# Altium schematic sheet HALL_SENSORS.SchDoc
size A2; SheetNumber: 1; SheetTotal: 1
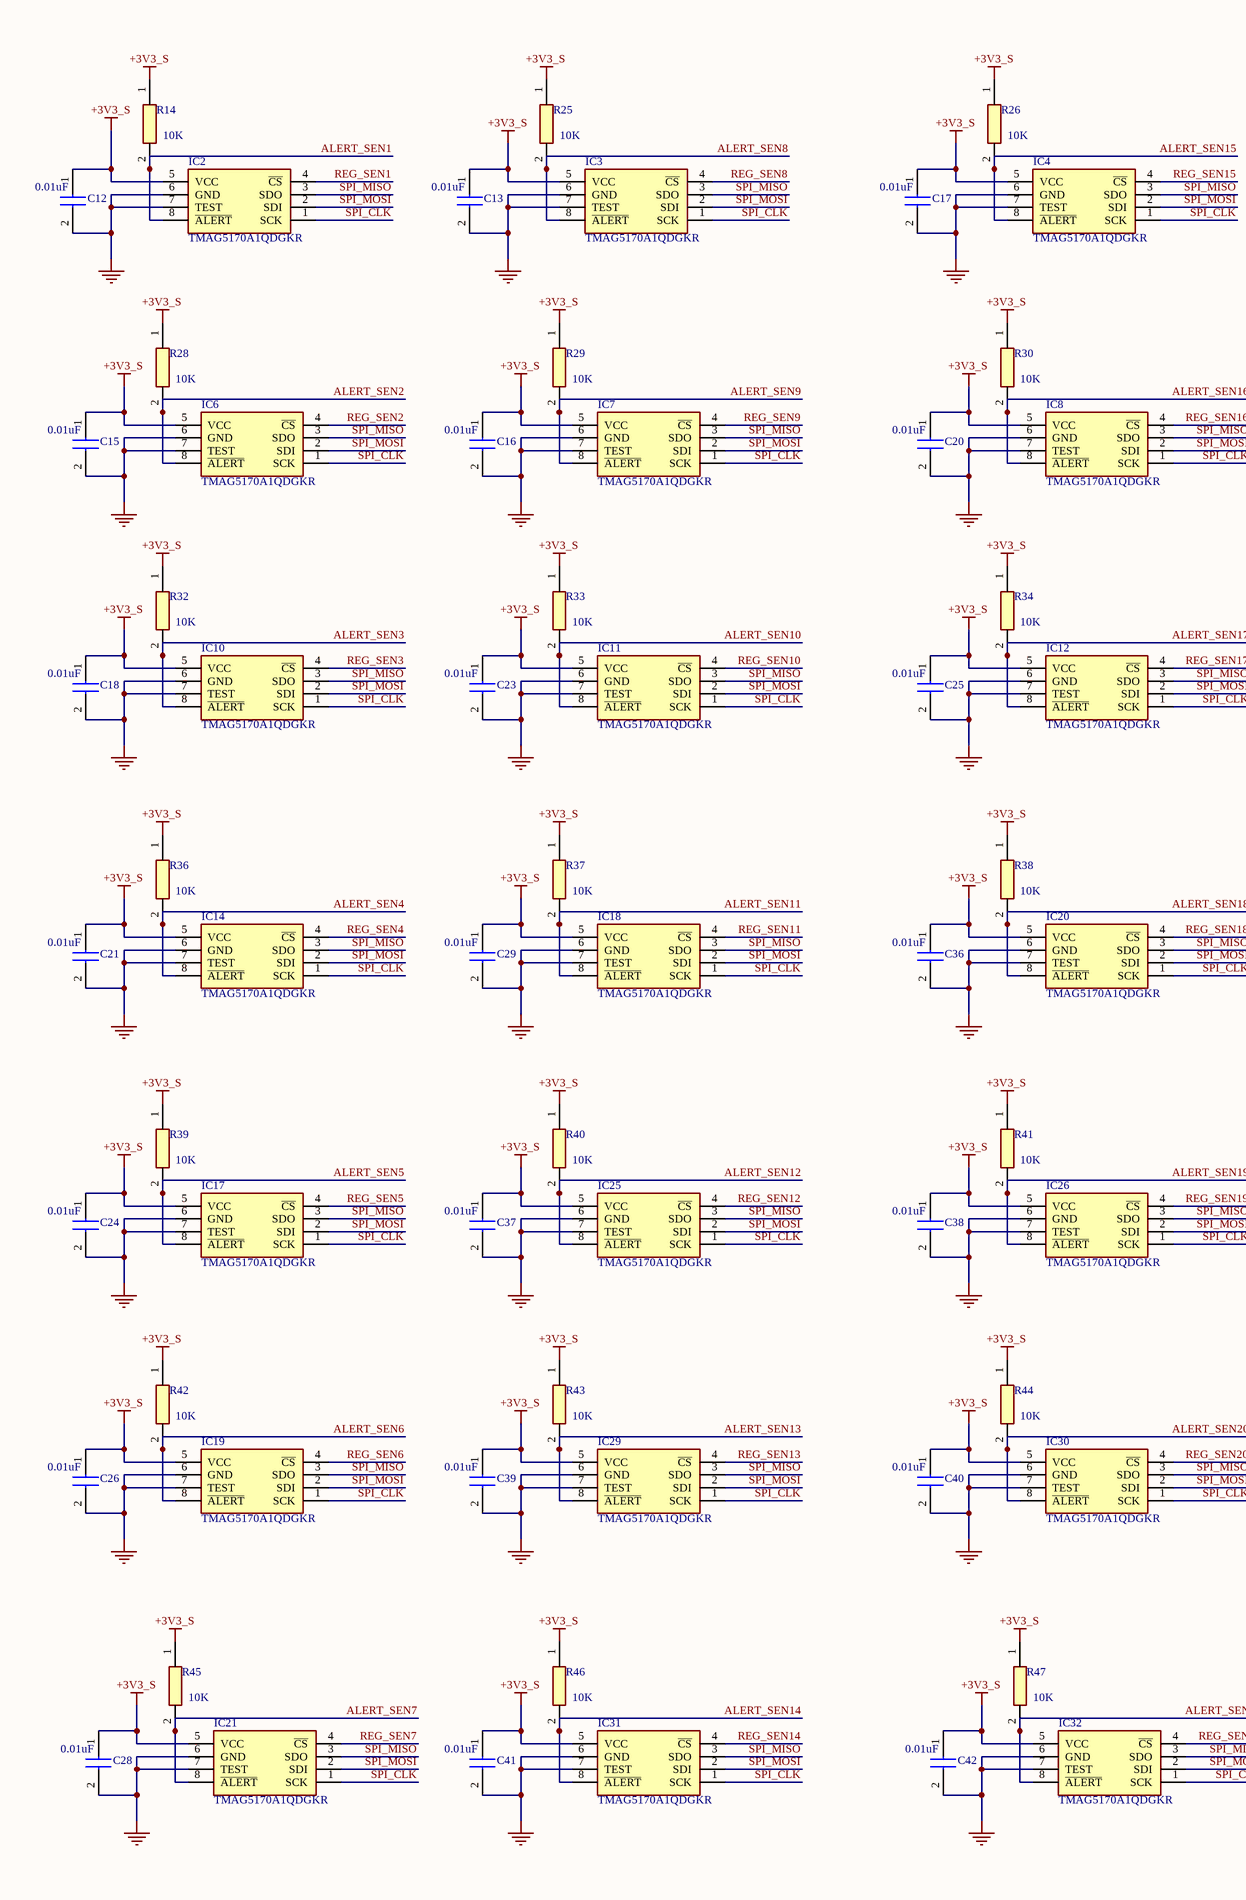
[diagram p0: HALL_SENSORS.SchDoc, left]
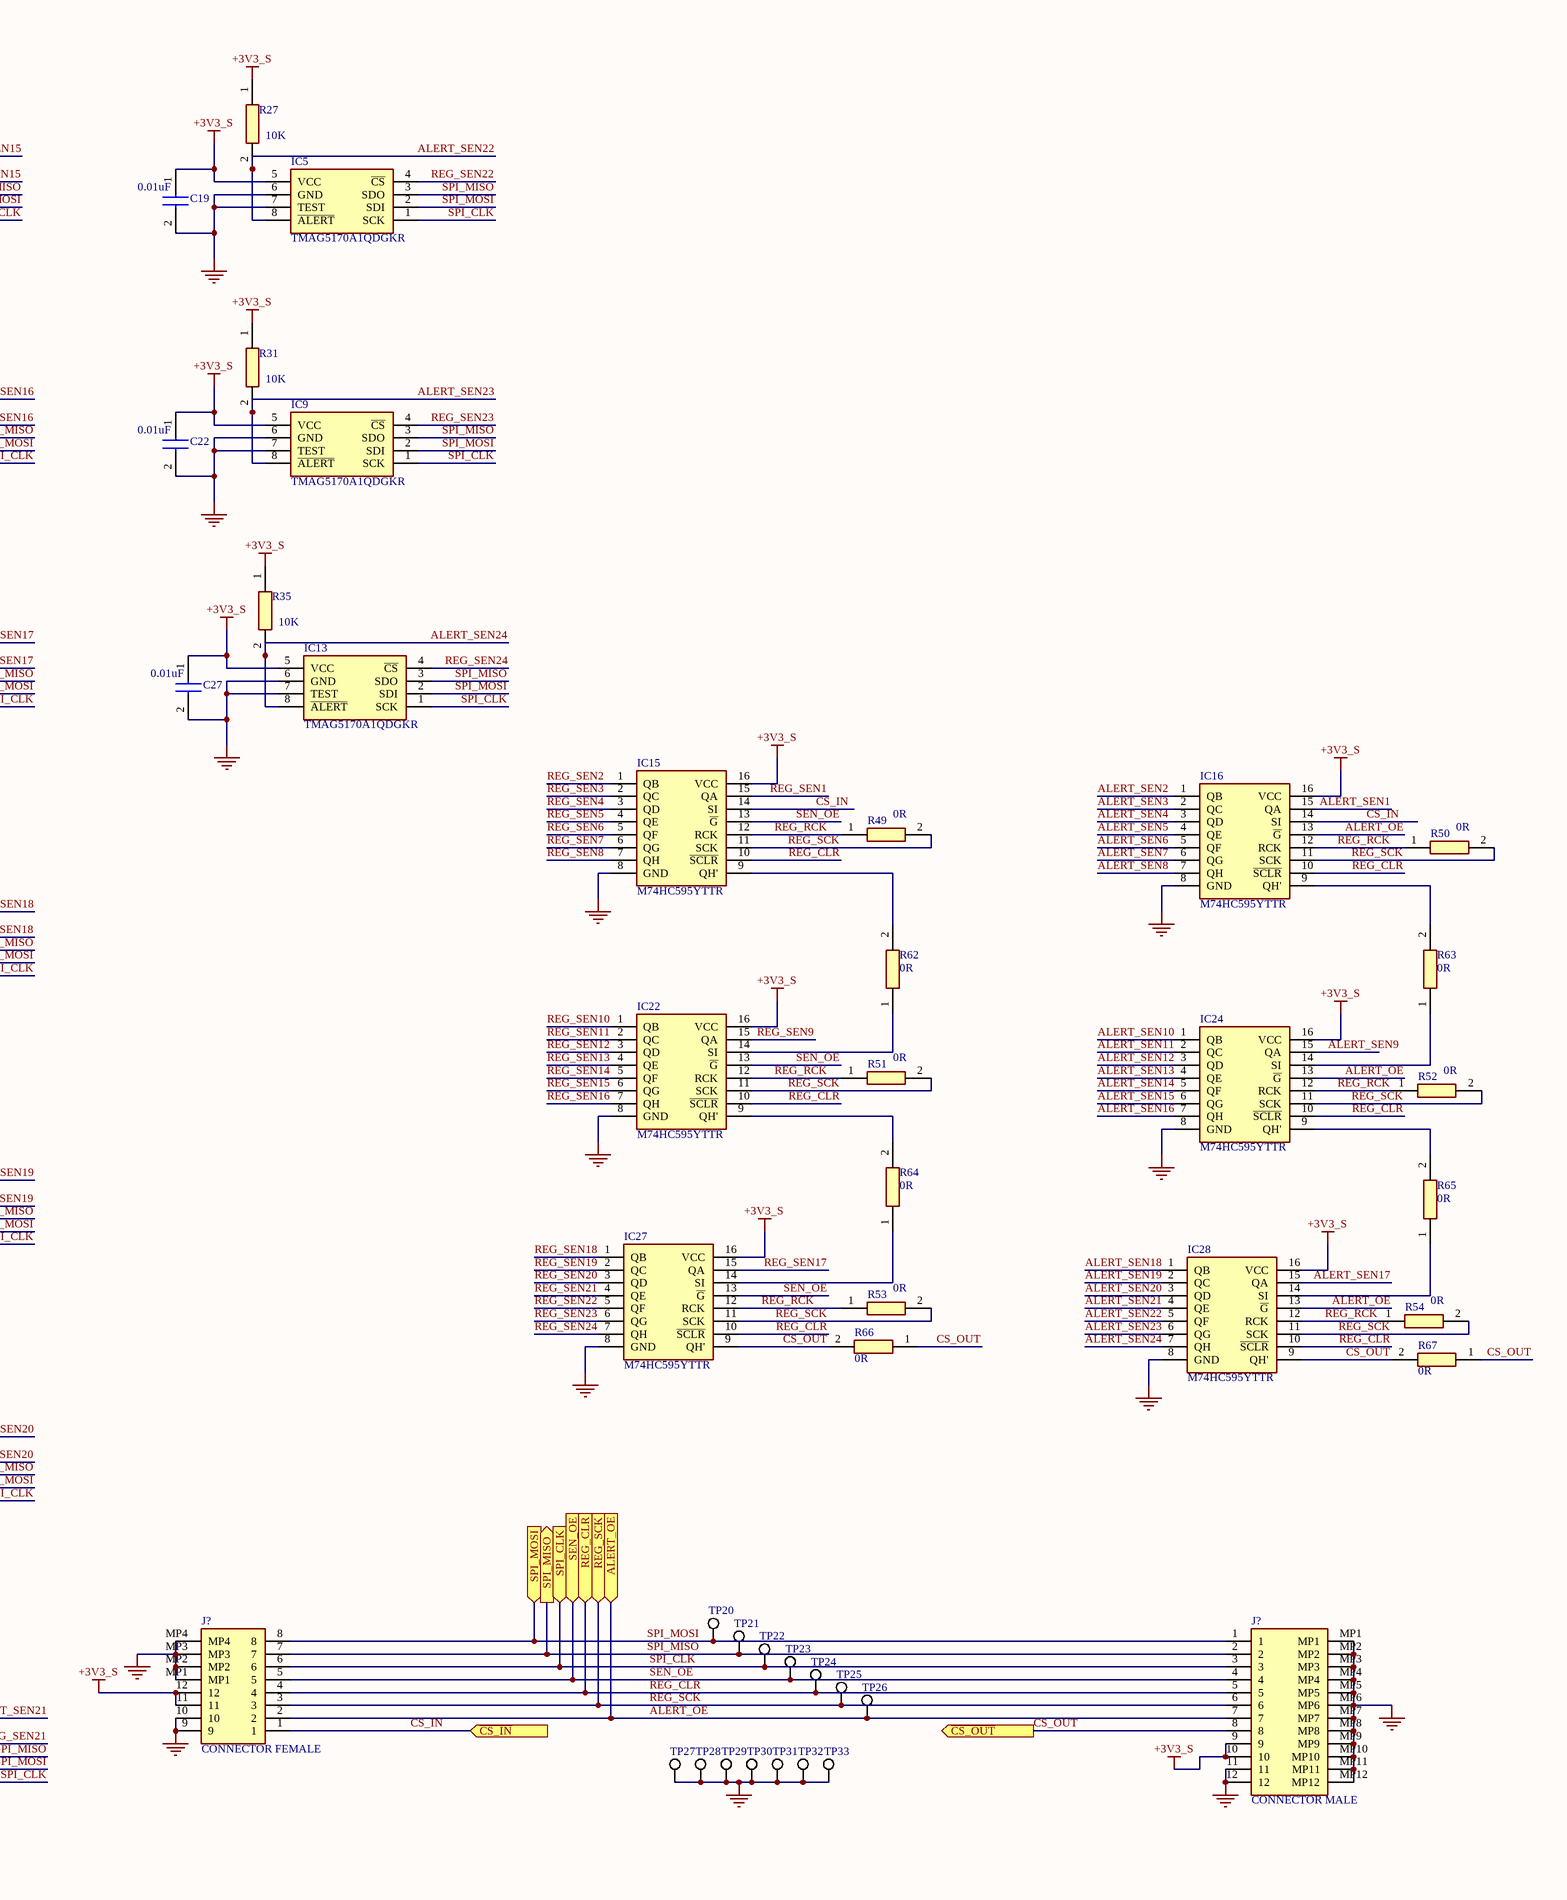
[diagram p1: HALL_SENSORS.SchDoc, right]

## Parts
(Parts that share a designator on the sheet are numbered #1, #2 ... from top to bottom, then left to right.)
C12  0.01uF  [CAPC2012X88N]
C13  0.01uF  [CAPC2012X88N]
C15  0.01uF  [CAPC2012X88N]
C16  0.01uF  [CAPC2012X88N]
C17  0.01uF  [CAPC2012X88N]
C18  0.01uF  [CAPC2012X88N]
C19  0.01uF  [CAPC2012X88N]
C20  0.01uF  [CAPC2012X88N]
C21  0.01uF  [CAPC2012X88N]
C22  0.01uF  [CAPC2012X88N]
C23  0.01uF  [CAPC2012X88N]
C24  0.01uF  [CAPC2012X88N]
C25  0.01uF  [CAPC2012X88N]
C26  0.01uF  [CAPC2012X88N]
C27  0.01uF  [CAPC2012X88N]
C28  0.01uF  [CAPC2012X88N]
C29  0.01uF  [CAPC2012X88N]
C36  0.01uF  [CAPC2012X88N]
C37  0.01uF  [CAPC2012X88N]
C38  0.01uF  [CAPC2012X88N]
C39  0.01uF  [CAPC2012X88N]
C40  0.01uF  [CAPC2012X88N]
C41  0.01uF  [CAPC2012X88N]
C42  0.01uF  [CAPC2012X88N]
IC2  TMAG5170A1QDGKR  [SOP65P490X110-8N]
IC3  TMAG5170A1QDGKR  [SOP65P490X110-8N]
IC4  TMAG5170A1QDGKR  [SOP65P490X110-8N]
IC5  TMAG5170A1QDGKR  [SOP65P490X110-8N]
IC6  TMAG5170A1QDGKR  [SOP65P490X110-8N]
IC7  TMAG5170A1QDGKR  [SOP65P490X110-8N]
IC8  TMAG5170A1QDGKR  [SOP65P490X110-8N]
IC9  TMAG5170A1QDGKR  [SOP65P490X110-8N]
IC10  TMAG5170A1QDGKR  [SOP65P490X110-8N]
IC11  TMAG5170A1QDGKR  [SOP65P490X110-8N]
IC12  TMAG5170A1QDGKR  [SOP65P490X110-8N]
IC13  TMAG5170A1QDGKR  [SOP65P490X110-8N]
IC14  TMAG5170A1QDGKR  [SOP65P490X110-8N]
IC15  M74HC595YTTR  [SOP65P640X120-16N]
IC16  M74HC595YTTR  [SOP65P640X120-16N]
IC17  TMAG5170A1QDGKR  [SOP65P490X110-8N]
IC18  TMAG5170A1QDGKR  [SOP65P490X110-8N]
IC19  TMAG5170A1QDGKR  [SOP65P490X110-8N]
IC20  TMAG5170A1QDGKR  [SOP65P490X110-8N]
IC21  TMAG5170A1QDGKR  [SOP65P490X110-8N]
IC22  M74HC595YTTR  [SOP65P640X120-16N]
IC24  M74HC595YTTR  [SOP65P640X120-16N]
IC25  TMAG5170A1QDGKR  [SOP65P490X110-8N]
IC26  TMAG5170A1QDGKR  [SOP65P490X110-8N]
IC27  M74HC595YTTR  [SOP65P640X120-16N]
IC28  M74HC595YTTR  [SOP65P640X120-16N]
IC29  TMAG5170A1QDGKR  [SOP65P490X110-8N]
IC30  TMAG5170A1QDGKR  [SOP65P490X110-8N]
IC31  TMAG5170A1QDGKR  [SOP65P490X110-8N]
IC32  TMAG5170A1QDGKR  [SOP65P490X110-8N]
J?#1  CONNECTOR MALE  [BM46B12DS035V53]
J?#2  CONNECTOR FEMALE  [BM46B12DP035V53]
R14  10K  [RESC1608X55N]
R25  10K  [RESC1608X55N]
R26  10K  [RESC1608X55N]
R27  10K  [RESC1608X55N]
R28  10K  [RESC1608X55N]
R29  10K  [RESC1608X55N]
R30  10K  [RESC1608X55N]
R31  10K  [RESC1608X55N]
R32  10K  [RESC1608X55N]
R33  10K  [RESC1608X55N]
R34  10K  [RESC1608X55N]
R35  10K  [RESC1608X55N]
R36  10K  [RESC1608X55N]
R37  10K  [RESC1608X55N]
R38  10K  [RESC1608X55N]
R39  10K  [RESC1608X55N]
R40  10K  [RESC1608X55N]
R41  10K  [RESC1608X55N]
R42  10K  [RESC1608X55N]
R43  10K  [RESC1608X55N]
R44  10K  [RESC1608X55N]
R45  10K  [RESC1608X55N]
R46  10K  [RESC1608X55N]
R47  10K  [RESC1608X55N]
R49  0R  [RESC1608X55N]
R50  0R  [RESC1608X55N]
R51  0R  [RESC1608X55N]
R52  0R  [RESC1608X55N]
R53  0R  [RESC1608X55N]
R54  0R  [RESC1608X55N]
R62  0R  [RESC1608X55N]
R63  0R  [RESC1608X55N]
R64  0R  [RESC1608X55N]
R65  0R  [RESC1608X55N]
R66  0R  [RESC1608X55N]
R67  0R  [RESC1608X55N]
TP20  5019  [KSTN-5019_V]  (value not drawn)
TP21  5019  [KSTN-5019_V]  (value not drawn)
TP22  5019  [KSTN-5019_V]  (value not drawn)
TP23  5019  [KSTN-5019_V]  (value not drawn)
TP24  5019  [KSTN-5019_V]  (value not drawn)
TP25  5019  [KSTN-5019_V]  (value not drawn)
TP26  5019  [KSTN-5019_V]  (value not drawn)
TP27  5019  [KSTN-5019_V]  (value not drawn)
TP28  5019  [KSTN-5019_V]  (value not drawn)
TP29  5019  [KSTN-5019_V]  (value not drawn)
TP30  5019  [KSTN-5019_V]  (value not drawn)
TP31  5019  [KSTN-5019_V]  (value not drawn)
TP32  5019  [KSTN-5019_V]  (value not drawn)
TP33  5019  [KSTN-5019_V]  (value not drawn)

## Ports
ALERT_OE (in), REG_CLR (in), REG_SCK (in), SEN_OE (in), SPI_CLK (in), SPI_MISO (out), SPI_MOSI (in), ~{CS_IN} (in), ~{CS_OUT} (out)

## Nets
+3V3_S: C12.1 C13.1 C15.1 C16.1 C17.1 C18.1 C19.1 C20.1 C21.1 C22.1 C23.1 C24.1 C25.1 C26.1 C27.1 C28.1 C29.1 C36.1 C37.1 C38.1 C39.1 C40.1 C41.1 C42.1 IC2.5(VCC) IC3.5(VCC) IC4.5(VCC) IC5.5(VCC) IC6.5(VCC) IC7.5(VCC) IC8.5(VCC) IC9.5(VCC) IC10.5(VCC) IC11.5(VCC) IC12.5(VCC) IC13.5(VCC) IC14.5(VCC) IC15.16(VCC) IC16.16(VCC) IC17.5(VCC) IC18.5(VCC) IC19.5(VCC) IC20.5(VCC) IC21.5(VCC) IC22.16(VCC) IC24.16(VCC) IC25.5(VCC) IC26.5(VCC) IC27.16(VCC) IC28.16(VCC) IC29.5(VCC) IC30.5(VCC) IC31.5(VCC) IC32.5(VCC) J?#1.9 J?#1.10 J?#2.11 J?#2.12 R14.1 R25.1 R26.1 R27.1 R28.1 R29.1 R30.1 R31.1 R32.1 R33.1 R34.1 R35.1 R36.1 R37.1 R38.1 R39.1 R40.1 R41.1 R42.1 R43.1 R44.1 R45.1 R46.1 R47.1
GND: C12.2 C13.2 C15.2 C16.2 C17.2 C18.2 C19.2 C20.2 C21.2 C22.2 C23.2 C24.2 C25.2 C26.2 C27.2 C28.2 C29.2 C36.2 C37.2 C38.2 C39.2 C40.2 C41.2 C42.2 IC2.6(GND) IC2.7(TEST) IC3.6(GND) IC3.7(TEST) IC4.6(GND) IC4.7(TEST) IC5.6(GND) IC5.7(TEST) IC6.6(GND) IC6.7(TEST) IC7.6(GND) IC7.7(TEST) IC8.6(GND) IC8.7(TEST) IC9.6(GND) IC9.7(TEST) IC10.6(GND) IC10.7(TEST) IC11.6(GND) IC11.7(TEST) IC12.6(GND) IC12.7(TEST) IC13.6(GND) IC13.7(TEST) IC14.6(GND) IC14.7(TEST) IC15.8(GND) IC16.8(GND) IC17.6(GND) IC17.7(TEST) IC18.6(GND) IC18.7(TEST) IC19.6(GND) IC19.7(TEST) IC20.6(GND) IC20.7(TEST) IC21.6(GND) IC21.7(TEST) IC22.8(GND) IC24.8(GND) IC25.6(GND) IC25.7(TEST) IC26.6(GND) IC26.7(TEST) IC27.8(GND) IC28.8(GND) IC29.6(GND) IC29.7(TEST) IC30.6(GND) IC30.7(TEST) IC31.6(GND) IC31.7(TEST) IC32.6(GND) IC32.7(TEST) J?#1.11 J?#1.12 J?#1.MP1 J?#1.MP2 J?#1.MP3 J?#1.MP4 J?#1.MP5 J?#1.MP6 J?#1.MP7 J?#1.MP8 J?#1.MP9 J?#1.MP10 J?#1.MP11 J?#1.MP12 J?#2.9 J?#2.10 J?#2.MP1 J?#2.MP2 J?#2.MP3 J?#2.MP4 TP27.1 TP28.1 TP29.1 TP30.1 TP31.1 TP32.1 TP33.1
ALERT_OE: IC16.13(~{G}) IC24.13(~{G}) IC28.13(~{G}) J?#1.7 J?#2.2 TP26.1 ; port ALERT_OE
ALERT_SEN1: IC2.8(~{ALERT}) IC16.15(QA) R14.2
ALERT_SEN2: IC6.8(~{ALERT}) IC16.1(QB) R28.2
ALERT_SEN3: IC10.8(~{ALERT}) IC16.2(QC) R32.2
ALERT_SEN4: IC14.8(~{ALERT}) IC16.3(QD) R36.2
ALERT_SEN5: IC16.4(QE) IC17.8(~{ALERT}) R39.2
ALERT_SEN6: IC16.5(QF) IC19.8(~{ALERT}) R42.2
ALERT_SEN7: IC16.6(QG) IC21.8(~{ALERT}) R45.2
ALERT_SEN8: IC3.8(~{ALERT}) IC16.7(QH) R25.2
ALERT_SEN9: IC7.8(~{ALERT}) IC24.15(QA) R29.2
ALERT_SEN10: IC11.8(~{ALERT}) IC24.1(QB) R33.2
ALERT_SEN11: IC18.8(~{ALERT}) IC24.2(QC) R37.2
ALERT_SEN12: IC24.3(QD) IC25.8(~{ALERT}) R40.2
ALERT_SEN13: IC24.4(QE) IC29.8(~{ALERT}) R43.2
ALERT_SEN14: IC24.5(QF) IC31.8(~{ALERT}) R46.2
ALERT_SEN15: IC4.8(~{ALERT}) IC24.6(QG) R26.2
ALERT_SEN16: IC8.8(~{ALERT}) IC24.7(QH) R30.2
ALERT_SEN17: IC12.8(~{ALERT}) IC28.15(QA) R34.2
ALERT_SEN18: IC20.8(~{ALERT}) IC28.1(QB) R38.2
ALERT_SEN19: IC26.8(~{ALERT}) IC28.2(QC) R41.2
ALERT_SEN20: IC28.3(QD) IC30.8(~{ALERT}) R44.2
ALERT_SEN21: IC28.4(QE) IC32.8(~{ALERT}) R47.2
ALERT_SEN22: IC5.8(~{ALERT}) IC28.5(QF) R27.2
ALERT_SEN23: IC9.8(~{ALERT}) IC28.6(QG) R31.2
ALERT_SEN24: IC13.8(~{ALERT}) IC28.7(QH) R35.2
CS_IN: IC15.14(SI) IC16.14(SI) J?#2.1 ; port ~{CS_IN}
CS_OUT: IC27.9(QH') IC28.9(QH') J?#1.8 R66.1 R66.2 R67.1 R67.2 ; port ~{CS_OUT}
REG_CLR: IC15.10(~{SCLR}) IC16.10(~{SCLR}) IC22.10(~{SCLR}) IC24.10(~{SCLR}) IC27.10(~{SCLR}) IC28.10(~{SCLR}) J?#1.5 J?#2.4 TP24.1 ; port REG_CLR
REG_RCK: IC15.12(RCK) IC16.12(RCK) IC22.12(RCK) IC24.12(RCK) IC27.12(RCK) IC28.12(RCK) R49.1 R50.1 R51.1 R52.1 R53.1 R54.1
REG_SCK: IC15.11(SCK) IC16.11(SCK) IC22.11(SCK) IC24.11(SCK) IC27.11(SCK) IC28.11(SCK) J?#1.6 J?#2.3 R49.2 R50.2 R51.2 R52.2 R53.2 R54.2 TP25.1 ; port REG_SCK
REG_SEN1: IC2.4(~{CS}) IC15.15(QA)
REG_SEN2: IC6.4(~{CS}) IC15.1(QB)
REG_SEN3: IC10.4(~{CS}) IC15.2(QC)
REG_SEN4: IC14.4(~{CS}) IC15.3(QD)
REG_SEN5: IC15.4(QE) IC17.4(~{CS})
REG_SEN6: IC15.5(QF) IC19.4(~{CS})
REG_SEN7: IC15.6(QG) IC21.4(~{CS})
REG_SEN8: IC3.4(~{CS}) IC15.7(QH)
REG_SEN9: IC7.4(~{CS}) IC22.15(QA)
REG_SEN10: IC11.4(~{CS}) IC22.1(QB)
REG_SEN11: IC18.4(~{CS}) IC22.2(QC)
REG_SEN12: IC22.3(QD) IC25.4(~{CS})
REG_SEN13: IC22.4(QE) IC29.4(~{CS})
REG_SEN14: IC22.5(QF) IC31.4(~{CS})
REG_SEN15: IC4.4(~{CS}) IC22.6(QG)
REG_SEN16: IC8.4(~{CS}) IC22.7(QH)
REG_SEN17: IC12.4(~{CS}) IC27.15(QA)
REG_SEN18: IC20.4(~{CS}) IC27.1(QB)
REG_SEN19: IC26.4(~{CS}) IC27.2(QC)
REG_SEN20: IC27.3(QD) IC30.4(~{CS})
REG_SEN21: IC27.4(QE) IC32.4(~{CS})
REG_SEN22: IC5.4(~{CS}) IC27.5(QF)
REG_SEN23: IC9.4(~{CS}) IC27.6(QG)
REG_SEN24: IC13.4(~{CS}) IC27.7(QH)
SEN_OE: IC15.13(~{G}) IC22.13(~{G}) IC27.13(~{G}) J?#1.4 J?#2.5 TP23.1 ; port SEN_OE
SPI_CLK: IC2.1(SCK) IC3.1(SCK) IC4.1(SCK) IC5.1(SCK) IC6.1(SCK) IC7.1(SCK) IC8.1(SCK) IC9.1(SCK) IC10.1(SCK) IC11.1(SCK) IC12.1(SCK) IC13.1(SCK) IC14.1(SCK) IC17.1(SCK) IC18.1(SCK) IC19.1(SCK) IC20.1(SCK) IC21.1(SCK) IC25.1(SCK) IC26.1(SCK) IC29.1(SCK) IC30.1(SCK) IC31.1(SCK) IC32.1(SCK) J?#1.3 J?#2.6 TP22.1 ; port SPI_CLK
SPI_MISO: IC2.3(SDO) IC3.3(SDO) IC4.3(SDO) IC5.3(SDO) IC6.3(SDO) IC7.3(SDO) IC8.3(SDO) IC9.3(SDO) IC10.3(SDO) IC11.3(SDO) IC12.3(SDO) IC13.3(SDO) IC14.3(SDO) IC17.3(SDO) IC18.3(SDO) IC19.3(SDO) IC20.3(SDO) IC21.3(SDO) IC25.3(SDO) IC26.3(SDO) IC29.3(SDO) IC30.3(SDO) IC31.3(SDO) IC32.3(SDO) J?#1.2 J?#2.7 TP21.1 ; port SPI_MISO
SPI_MOSI: IC2.2(SDI) IC3.2(SDI) IC4.2(SDI) IC5.2(SDI) IC6.2(SDI) IC7.2(SDI) IC8.2(SDI) IC9.2(SDI) IC10.2(SDI) IC11.2(SDI) IC12.2(SDI) IC13.2(SDI) IC14.2(SDI) IC17.2(SDI) IC18.2(SDI) IC19.2(SDI) IC20.2(SDI) IC21.2(SDI) IC25.2(SDI) IC26.2(SDI) IC29.2(SDI) IC30.2(SDI) IC31.2(SDI) IC32.2(SDI) J?#1.1 J?#2.8 TP20.1 ; port SPI_MOSI
NetIC15_9: IC15.9(QH') R62.2
NetIC16_9: IC16.9(QH') R63.2
NetIC22_9: IC22.9(QH') R64.2
NetIC22_14: IC22.14(SI) R62.1
NetIC24_9: IC24.9(QH') R65.2
NetIC24_14: IC24.14(SI) R63.1
NetIC27_14: IC27.14(SI) R64.1
NetIC28_14: IC28.14(SI) R65.1

## Library data of the parts
C12 C13 C15-C29 C36-C42 = C0805C103J5RAC7025: Capacitor; Manufacturer_Name: KEMET; Datasheet Link: https://componentsearchengine.com/Datasheets/1/C0805C103J5RAC7025.pdf; Height: 0.88mm; Manufacturer_Part_Number: C0805C103J5RAC7025; Mouser Part Number: 80-C0805C103J5RACTM; Mouser Price/Stock: https://www.mouser.co.uk/ProductDetail/KEMET/C0805C103J5RAC7025?qs=OST0ycsSJhUuY%252B8klXMlUw%3D%3D
IC2-IC14 IC17-IC21 IC25 IC26 IC29-IC32 = TMAG5170A1QDGKR: Integrated Circuit; Manufacturer_Name: Texas Instruments; Datasheet Link: https://www.ti.com/lit/ds/symlink/tmag5170.pdf?ts=1631468164599&ref_url=https%253A%252F%252Fwww.ti.com%252Fsitesearch%252Fdocs%252Funiversalsearch.tsp%253FlangPref%253Den-US%2526searchTerm%253DTMAG5170A1QDGKR%2526nr%253D4; Height: 1.1mm; Manufacturer_Part_Number: TMAG5170A1QDGKR; Mouser Part Number: 595-TMAG5170A1QDGKR; Mouser Price/Stock: https://www.mouser.co.uk/ProductDetail/Texas-Instruments/TMAG5170A1QDGKR?qs=7D1LtPJG0i2KumggWL5Glw%3D%3D; Arrow Part Number: TMAG5170A1QDGKR; Arrow Price/Stock: https://www.arrow.com/en/products/tmag5170a1qdgkr/texas-instruments?region=nac
IC15 IC16 IC22 IC24 IC27 IC28 = M74HC595YTTR: Integrated Circuit; Manufacturer_Name: STMicroelectronics; Datasheet Link: https://componentsearchengine.com/Datasheets/1/M74HC595YTTR.pdf; Height: 1.2mm; Manufacturer_Part_Number: M74HC595YTTR; Mouser Part Number: 511-M74HC595YTTR; Mouser Price/Stock: https://www.mouser.co.uk/ProductDetail/STMicroelectronics/M74HC595YTTR?qs=WHlX%252B%252B9%2FRwCpo6YE5YKRQQ%3D%3D; Arrow Part Number: M74HC595YTTR; Arrow Price/Stock: https://www.arrow.com/en/products/m74hc595yttr/stmicroelectronics
J?#1 = BM46B-12DS-0.35V_53_: Connector; Manufacturer_Name: Hirose; Manufacturer_Part_Number: BM46B-12DS-0.35V(53); Datasheet Link: https://componentsearchengine.com/Datasheets/1/BM46B-12DS-0.35V(53).pdf; Height: 0.7mm; Mouser Part Number: 798-BM46B-12DS035V53; Mouser Price/Stock: https://www.mouser.co.uk/ProductDetail/Hirose-Connector/BM46B-12DS-0.35V53?qs=Cb2nCFKsA8owNdPkaYVvTg%3D%3D
J?#2 = BM46B-12DP-0.35V_53_: Connector; Manufacturer_Name: Hirose; Manufacturer_Part_Number: BM46B-12DP-0.35V(53); Datasheet Link: https://componentsearchengine.com/Datasheets/2/BM46B-12DP-0.35V(53).pdf; Height: 0.57mm; Mouser Part Number: 798-BM46B-12DP035V53; Mouser Price/Stock: https://www.mouser.co.uk/ProductDetail/Hirose-Connector/BM46B-12DP-0.35V53?qs=Cb2nCFKsA8r3RzUEkg7NDQ%3D%3D
R14 R25-R47 R49-R54 R62-R67 = RK73B1JTTD103J: Resistor; Manufacturer_Name: KOA Speer; Datasheet Link: http://www.koaspeer.com/catimages/Products/RK73-RT/RK73-RT.pdf; Height: 0.55mm; Manufacturer_Part_Number: RK73B1JTTD103J; Mouser Part Number: 660-RK73B1JTTD103J; Mouser Price/Stock: https://www.mouser.co.uk/ProductDetail/KOA-Speer/RK73B1JTTD103J?qs=hmtrJ2UjXcBKRTcwO9LloQ%3D%3D; Arrow Part Number: RK73B1JTTD103J; Arrow Price/Stock: https://www.arrow.com/en/products/rk73b1jttd103j/koa-speer-electronics?region=asia
TP20-TP33 = CMP-1672-00008-1: Test Point, 1 Position SMD, RoHS, Tape and Reel; ComponentLink1Description: Manufacturer URL; Package Quantity: 1000; DatasheetVersion: 03/2014; Packaging: Tape and Reel; ComponentLink2URL: http://www.keyelco.com/product-pdf.cfm?p=1357; ComponentLink1URL: http://www.keyelco.com/; Mount: Surface Mount; Contact Plating: Silver; PackageDescription: 1-Pin Surface Mount Device, Body 3.81 x 2.03 mm; Pins: 1; RoHSCompliant: True; Mounting Technology: Surface Mount; ComponentLink2Description: Datasheet; PackageReference: 5019